# EAGLE design LPEM (EAGLE 9.4.1)

## Sheet 1 of 2
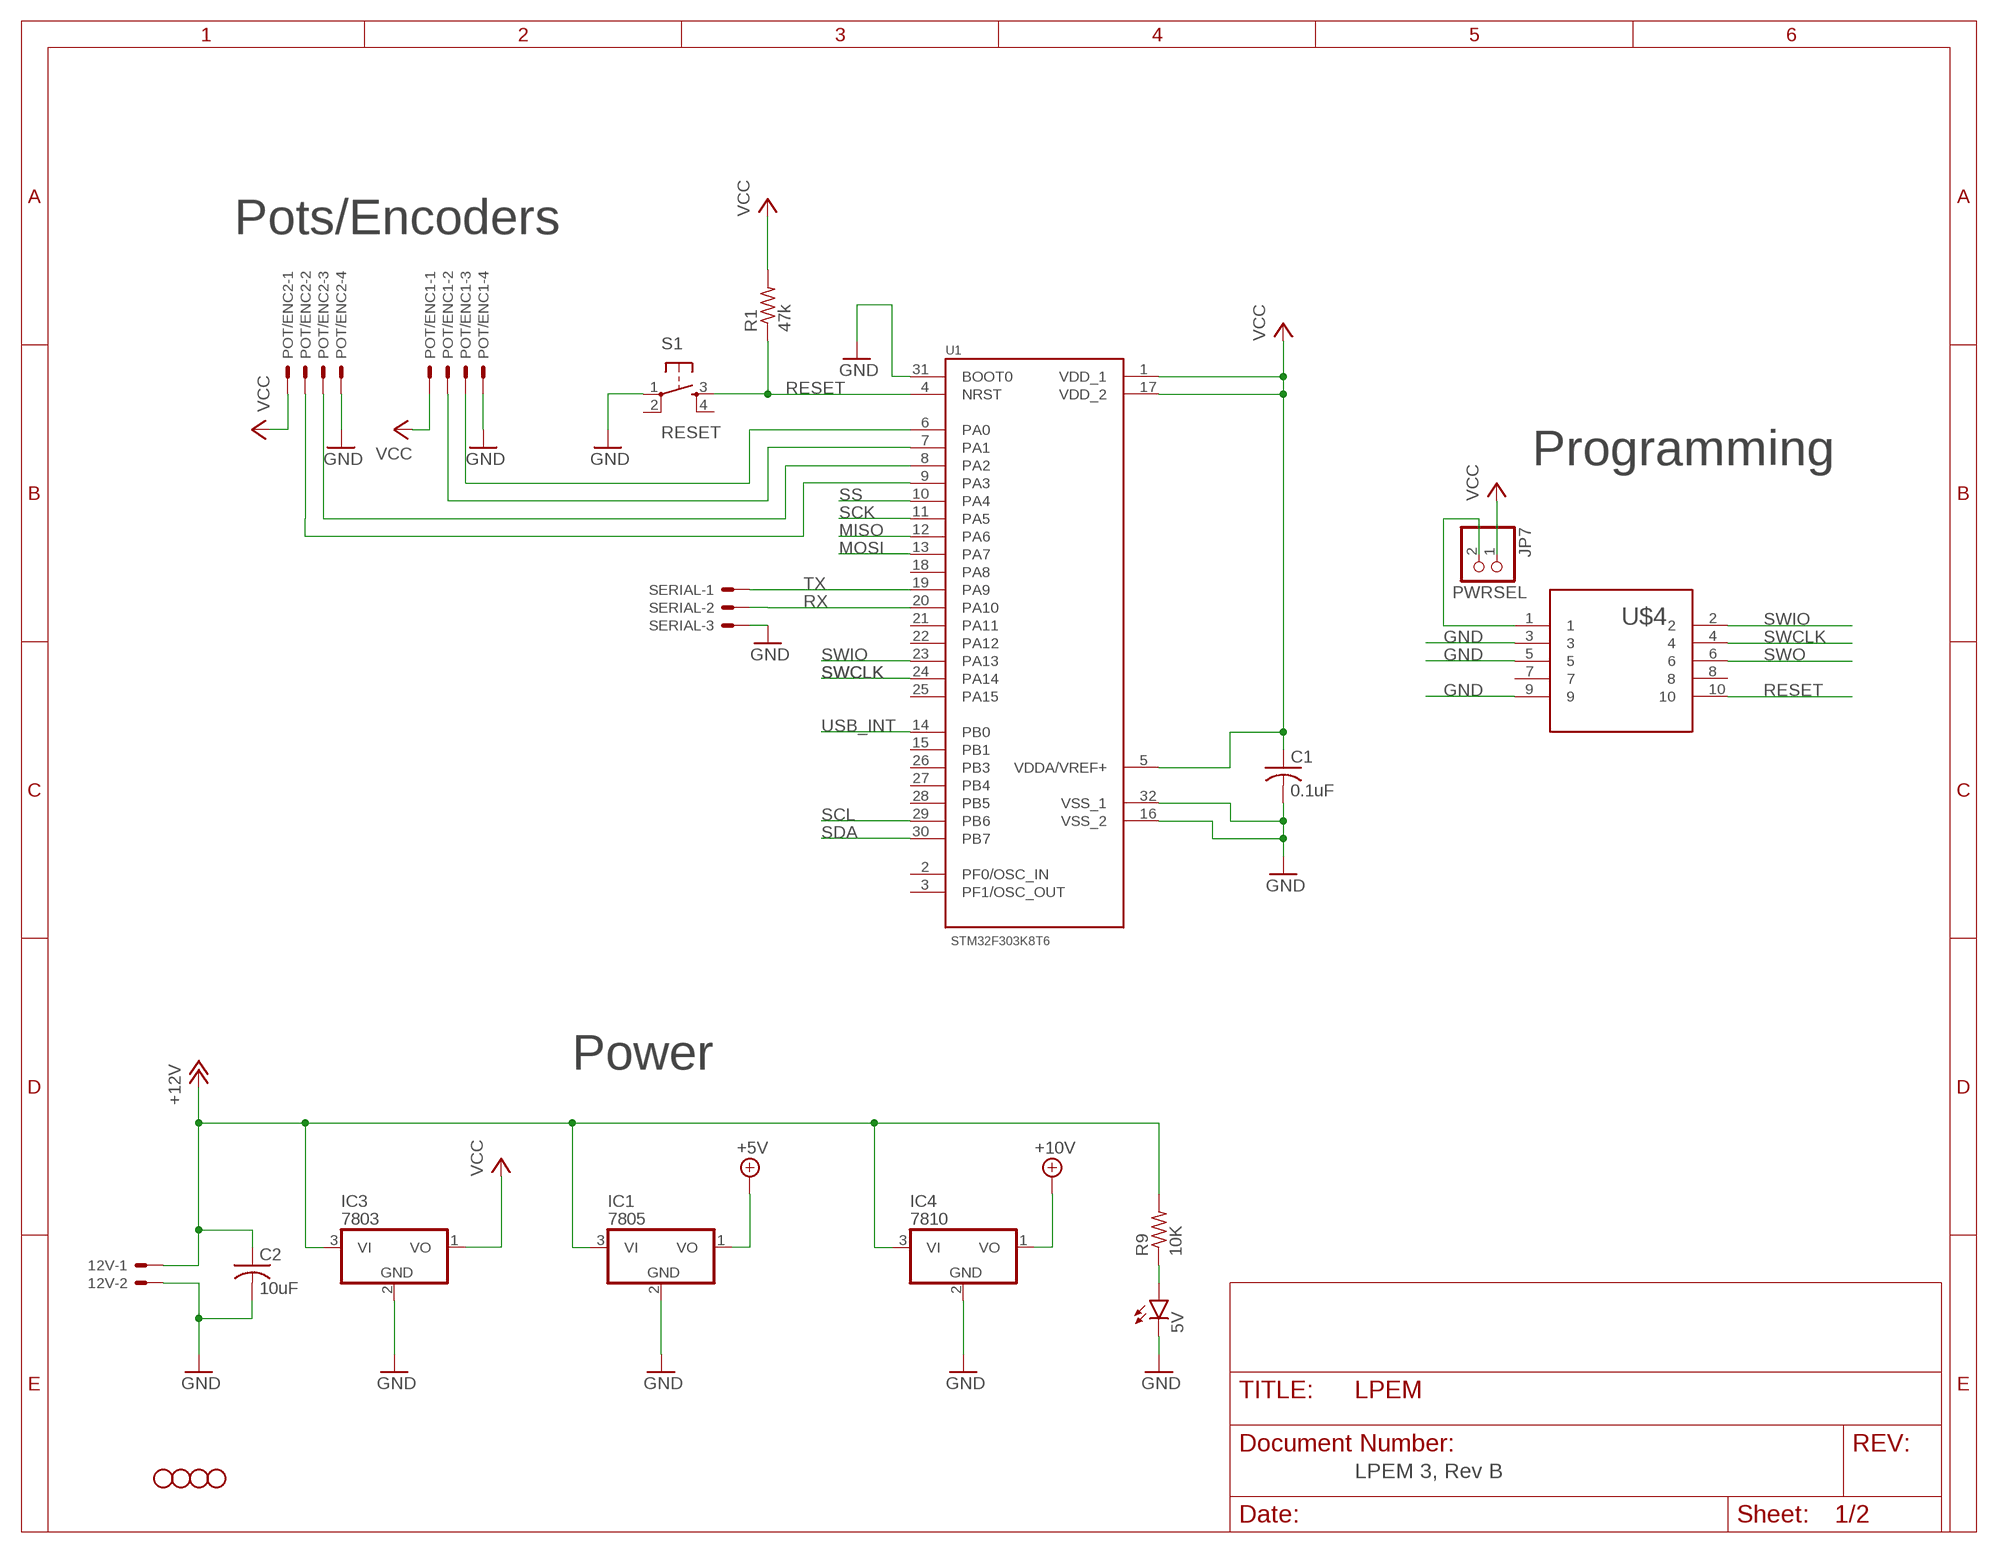
[diagram p0: schematic, sheet 1]

### Parts
5V  LED3MM  [LED3MM]
12V  22-23-2021  [22-23-2021]
C1  0.1uF  C-US025-025X050  [C025-025X050]
C2  10uF  C-US025-025X050  [C025-025X050]
IC1  7805  78L05Z  [TO92]
IC3  7803  78L05Z  [TO92]
IC4  7810  78L05Z  [TO92]
JP1  STAND-OFF  [STAND-OFF]
JP2  STAND-OFF  [STAND-OFF]
JP7  PWRSEL  PINHD-1X2  [1X02]
JP8  STAND-OFF  [STAND-OFF]
JP9  STAND-OFF  [STAND-OFF]
POT/ENC1  22-23-2041  [22-23-2041]
POT/ENC2  22-23-2041  [22-23-2041]
R1  47k  R-US_0204/5  [0204/5]
R9  10K  R-US_0204/5  [0204/5]
S1  RESET  TAC_SWITCHPTH  [TACTILE-PTH]
SERIAL  22-23-2031  [22-23-2031]
U1  STM32F303K8T6  [QFP80P900X900X160-32N]
U$4  CORTEX_HEADERJ  [CORTEX_HEADER]

### Nets
+5V [power]: IC1.1(VO) ; also sheet 2
+10V [power]: IC4.1(VO) ; also sheet 2
+12V [power]: 12V.1 C2.1 IC1.3(VI) IC3.3(VI) IC4.3(VI) R9.2 ; also sheet 2
GND [power]: 5V.K(C) 12V.2 C1.2 C2.2 IC1.2(GND) IC3.2(GND) IC4.2(GND) POT/ENC1.4 POT/ENC2.4 S1.1 SERIAL.3 U1.16(VSS_2) U1.31(BOOT0) U1.32(VSS_1) U$4.3 U$4.5 U$4.9 ; also sheet 2
MISO: U1.12(PA6) ; also sheet 2
MOSI: U1.13(PA7) ; also sheet 2
N$1: POT/ENC2.3 U1.8(PA2)
N$2: POT/ENC2.2 U1.9(PA3)
N$3: POT/ENC1.3 U1.6(PA0)
N$4: JP7.2 U$4.1
N$5: 5V.A R9.1
N$6: POT/ENC1.2 U1.7(PA1)
RESET: R1.1 S1.3 U1.4(NRST) U$4.10
RX: SERIAL.2 U1.20(PA10)
SCK: U1.11(PA5) ; also sheet 2
SCL: U1.29(PB6) ; also sheet 2
SDA: U1.30(PB7) ; also sheet 2
SS: U1.10(PA4) ; also sheet 2
SWCLK: U1.24(PA14) U$4.4
SWIO: U1.23(PA13) U$4.2
SWO: U$4.6
TX: SERIAL.1 U1.19(PA9)
USB_INT: U1.14(PB0) ; also sheet 2
VCC [power]: C1.1 IC3.1(VO) JP7.1 POT/ENC1.1 POT/ENC2.1 R1.2 U1.1(VDD_1) U1.5(VDDA/VREF+) U1.17(VDD_2) ; also sheet 2
Unconnected: S1.2 S1.4 U1.2(PF0/OSC_IN) U1.3(PF1/OSC_OUT) U1.15(PB1) U1.18(PA8) U1.21(PA11) U1.22(PA12) U1.25(PA15) U1.26(PB3) U1.27(PB4) U1.28(PB5) U$4.7 U$4.8

### Notes on the sheet
- Pots/Encoders
- Programming
- Power
- LPEM 3, Rev B

## Sheet 2 of 2
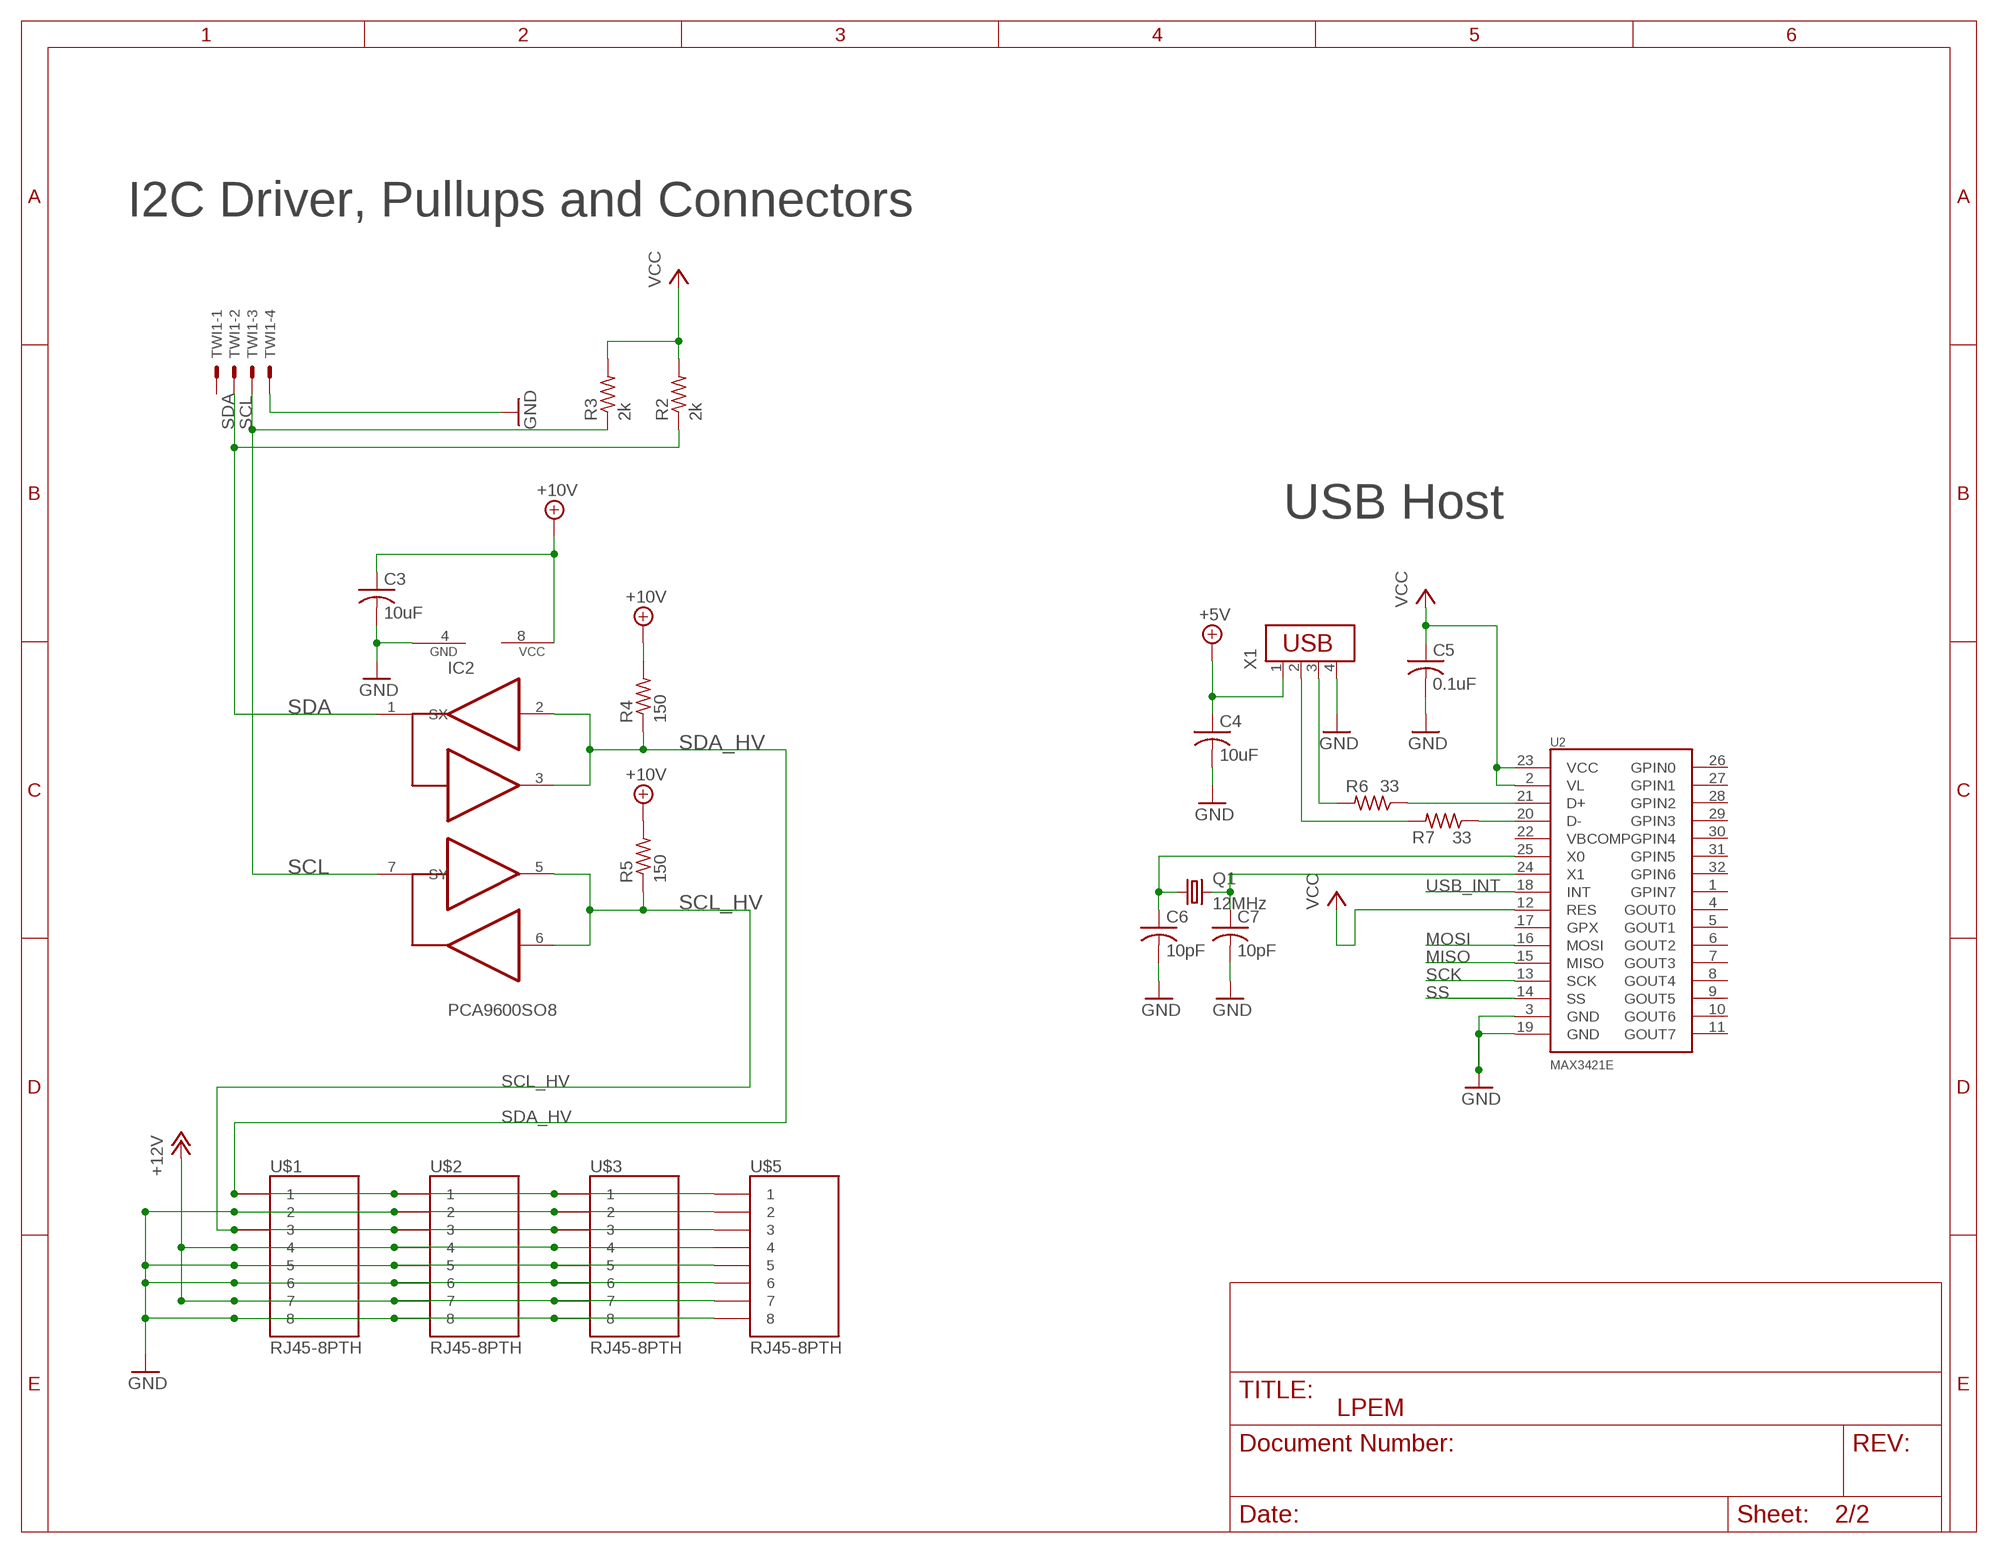
[diagram p1: schematic, sheet 2]

### Parts
C3  10uF  C-US025-025X050  [C025-025X050]
C4  10uF  C-US025-025X050  [C025-025X050]
C5  0.1uF  C-US025-025X050  [C025-025X050]
C6  10pF  C-US025-025X050  [C025-025X050]
C7  10pF  C-US025-025X050  [C025-025X050]
IC2  PCA9600SO8  [SO08]
Q1  12MHz  CRYSTALHC18U-V  [HC18U-V]
R2  2k  R-US_0204/5  [0204/5]
R3  2k  R-US_0204/5  [0204/5]
R4  150  R-US_0204/5  [0204/5]
R5  150  R-US_0204/5  [0204/5]
R6  33  R-US_0204/5  [0204/5]
R7  33  R-US_0204/5  [0204/5]
TWI1  22-23-2041  [22-23-2041]
U2  MAX3421E  [TQFP32-5MM]
U$1  RJ45-8PTH  [RJ45-8]
U$2  RJ45-8PTH  [RJ45-8]
U$3  RJ45-8PTH  [RJ45-8]
U$5  RJ45-8PTH  [RJ45-8]
X1  USB-787616  [USB]

### Nets
+5V [power]: C4.1 X1.1 ; also sheet 1
+10V [power]: C3.1 IC2.8(VCC) R4.2 R5.2 ; also sheet 1
+12V [power]: U$1.4 U$1.7 U$2.4 U$2.7 U$3.4 U$3.7 U$5.4 U$5.7 ; also sheet 1
GND [power]: C3.2 C4.2 C5.2 C6.2 C7.2 IC2.4(GND) TWI1.4 U2.3(GND) U2.19(GND) U$1.2 U$1.5 U$1.6 U$1.8 U$2.2 U$2.5 U$2.6 U$2.8 U$3.2 U$3.5 U$3.6 U$3.8 U$5.2 U$5.5 U$5.6 U$5.8 X1.4 ; also sheet 1
MISO: U2.15(MISO) ; also sheet 1
MOSI: U2.16(MOSI) ; also sheet 1
N$7: R6.2 X1.3
N$8: R7.2 X1.2
N$9: C6.1 Q1.1 U2.25(X0)
N$10: C7.1 Q1.2 U2.24(X1)
N$11: R6.1 U2.21(D+)
N$12: R7.1 U2.20(D-)
SCK: U2.13(SCK) ; also sheet 1
SCL: IC2.7(SY) R3.1 TWI1.3 ; also sheet 1
SCL_HV: IC2.5(TY) IC2.6(RY) R5.1 U$1.3 U$2.3 U$3.3 U$5.3
SDA: IC2.1(SX) R2.1 TWI1.2 ; also sheet 1
SDA_HV: IC2.2(RX) IC2.3(TX) R4.1 U$1.1 U$2.1 U$3.1 U$5.1
SS: U2.14(SS) ; also sheet 1
USB_INT: U2.18(INT) ; also sheet 1
VCC [power]: C5.1 R2.2 R3.2 U2.2(VL) U2.12(RES) U2.23(VCC) ; also sheet 1
Unconnected: TWI1.1 U2.1(GPIN7) U2.4(GOUT0) U2.5(GOUT1) U2.6(GOUT2) U2.7(GOUT3) U2.8(GOUT4) U2.9(GOUT5) U2.10(GOUT6) U2.11(GOUT7) U2.17(GPX) U2.22(VBCOMP) U2.26(GPIN0) U2.27(GPIN1) U2.28(GPIN2) U2.29(GPIN3) U2.30(GPIN4) U2.31(GPIN5) U2.32(GPIN6)

### Notes on the sheet
- I2C Driver, Pullups and Connectors
- USB Host

## Library data of the parts
5V = led:LED: LED OSRAM: - CHIPLED LG R971, LG N971, LY N971, LG Q971, LY Q971, LO R971, LY R971 LH N974, LH R974 LS Q976, LO Q976, LY Q976 LO Q996 - Hyper CHIPLED LW Q18S LB Q993, LB Q99A, LB R99A - SideLED LS A670, LO A670, LY A670, LG A670, LP A670 LB A673, LV A673, LT A673, LW A673 LH A674 LY A675 LS A676, LA A676, LO A676, LY A676, LW A676 LS A679, LY A679, LG A679 - Hyper Micro SIDELED® LS Y876, LA Y876, LO Y876, LY Y876 LT Y87S - SmartLED LW L88C, LW L88S LB L89C, LB L89S, LG L890 LS L89K, LO L89K, LY L89K LS L896, LA L896, LO L896, LY L896 - TOPLED LS T670, LO T670, LY T670, LG T670, LP T670 LSG T670, LSP T670, LSY T670, LOP T670, LYG T670 LG T671, LOG T671, LSG T671 LB T673, LV T673, LT T673, LW T673 LH T674 LS T676, LA T676, LO T676, LY T676, LB T676, LH T676, LSB T676, LW T676 LB T67C, LV T67C, LT T67C, LS T67K, LO T67K, LY T67K, LW E67C LS E67B, LA E67B, LO E67B, LY E67B, LB E67C, LV E67C, LT E67C LW T67C LS T679, LY T679, LG T679 LS T770, LO T770, LY T770, LG T770, LP T770 LB T773, LV T773, LT T773, LW T773 LH T774 LS E675, LA E675, LY E675, LS T675 LS T776, LA T776, LO T776, LY T776, LB T776 LHGB T686 LT T68C, LB T68C - Hyper Mini TOPLED® LB M676 - Mini TOPLED Santana® LG M470 LS M47K, LO M47K, LY M47K Source: http://www.osram.convergy.de LUXEON: - LUMILED® LXK2-PW12-R00, LXK2-PW12-S00, LXK2-PW14-U00, LXK2-PW14-V00 LXK2-PM12-R00, LXK2-PM12-S00, LXK2-PM14-U00 LXK2-PE12-Q00, LXK2-PE12-R00, LXK2-PE12-S00, LXK2-PE14-T00, LXK2-PE14-U00 LXK2-PB12-K00, LXK2-PB12-L00, LXK2-PB12-M00, LXK2-PB14-N00, LXK2-PB14-P00, LXK2-PB14-Q00 LXK2-PR12-L00, LXK2-PR12-M00, LXK2-PR14-Q00, LXK2-PR14-R00 LXK2-PD12-Q00, LXK2-PD12-R00, LXK2-PD12-S00 LXK2-PH12-R00, LXK2-PH12-S00 LXK2-PL12-P00, LXK2-PL12-Q00, LXK2-PL12-R00 Source: www.luxeon.com KINGBRIGHT: KA-3528ASYC Source: www.kingbright.com
12V = con-molex:22-23-2021: .100" (2.54mm) Center Header - 2 Pin; MF: MOLEX; MPN: 22-23-2021; OC_FARNELL: 1462926; OC_NEWARK: 25C3832
C1-C7 = rcl:C-US: CAPACITOR, American symbol; SPICEPREFIX: C
IC1 IC3 IC4 = linear:78*: Positive VOLTAGE REGULATOR Source: http://cache.national.com/ds/LM/LM78L05.pdf http://www.fairchildsemi.com/ds/LM/LM7805.pdf
IC2 = 4534_I2C2:PCA9600: I2C ACTIVE TERMINATOR SO-8
JP1 JP2 JP8 JP9 = SparkFun:STAND-OFF: Stand Off This is the mechanical footprint for a #4 phillips button head screw. Use the keepout ring to avoid running the screw head into surrounding components. SKU : PRT-00447
JP7 = pinhead:PINHD-1X2: PIN HEADER
POT/ENC1 POT/ENC2 TWI1 = con-molex:22-23-2041: .100" (2.54mm) Center Header - 4 Pin; MF: MOLEX; MPN: 22-23-2041; OC_FARNELL: 1462920; OC_NEWARK: 38C0355
Q1 = crystal:CRYSTAL: CRYSTAL; OC_FARNELL: unknown; OC_NEWARK: unknown
R1-R7 R9 = rcl:R-US_: RESISTOR, American symbol; SPICEPREFIX: R
S1 = SparkFun:TAC_SWITCH: Momentary Switch Button commonly used for reset or general input. Spark Fun Electronics SKU : COM-00097
SERIAL = con-molex:22-23-2031: .100" (2.54mm) Center Header - 3 Pin; MF: MOLEX; MPN: 22-23-2031; OC_FARNELL: 1462950; OC_NEWARK: 30C0862
U1 = STM32F303K8T6:STM32F303K8T6: Analog and DSP with FPU ARM Cortex-M4 MCU with 64 Kbytes Flash, 72 MHz CPU, CCM, 12-bit ADC 5 MSPS, comparators, op-amp; AVAILABILITY: Unavailable; DESCRIPTION: Analog and DSP with FPU ARM Cortex-M4 MCU with 64 Kbytes Flash, 72 MHz CPU, CCM, 12-bit ADC 5 MSPS, comparators, op-amp; MF: STMicroelectronics; MP: STM32F303K8T6; PACKAGE: LQFP-32 STMicroelectronics; PRICE: None
U2 = MAX3421E:MAX3421E: USB Peripheral/Host Controller with SPI Interface.; AVAILABILITY: Unavailable; DESCRIPTION: 1.2v To +5.5v, ±15kv Esd-Protected, 0.1µa, 35mbps, 8-Channel Level Translators; MF: Maxim Integrated; MP: MAX3421E; PACKAGE: None; PRICE: None
U$1-U$3 U$5 = SparkFun:RJ45-8: RJ45 Jack Simple RJ45, 8-pin connection - connector for common Cat5, Cat5e, and Cat6 Ethernet cables. Footprint not yet proven in production. Connector sku is PRT-00643; Breakout PCB sku is BOB-00716.
U$4 = Lectrobox:CORTEX_HEADER; AVAILABILITY: Unavailable; DESCRIPTION: Conn Shrouded Header HDR 10 POS 1.27mm Solder ST Thru-Hole Tube; MF: Samtec Inc.; MP: TFM-105-01-S-D-WT; PACKAGE: None; PRICE: None
X1 = con-amp:USB-787616: AMP connector

## Net classes
0 default: width 0.152 mm, drill 0.152 mm, clearance 0.152 mm
1 power: width 0.305 mm, drill 0.305 mm, clearance 0.152 mm to class 0, clearance 0.152 mm

## Board
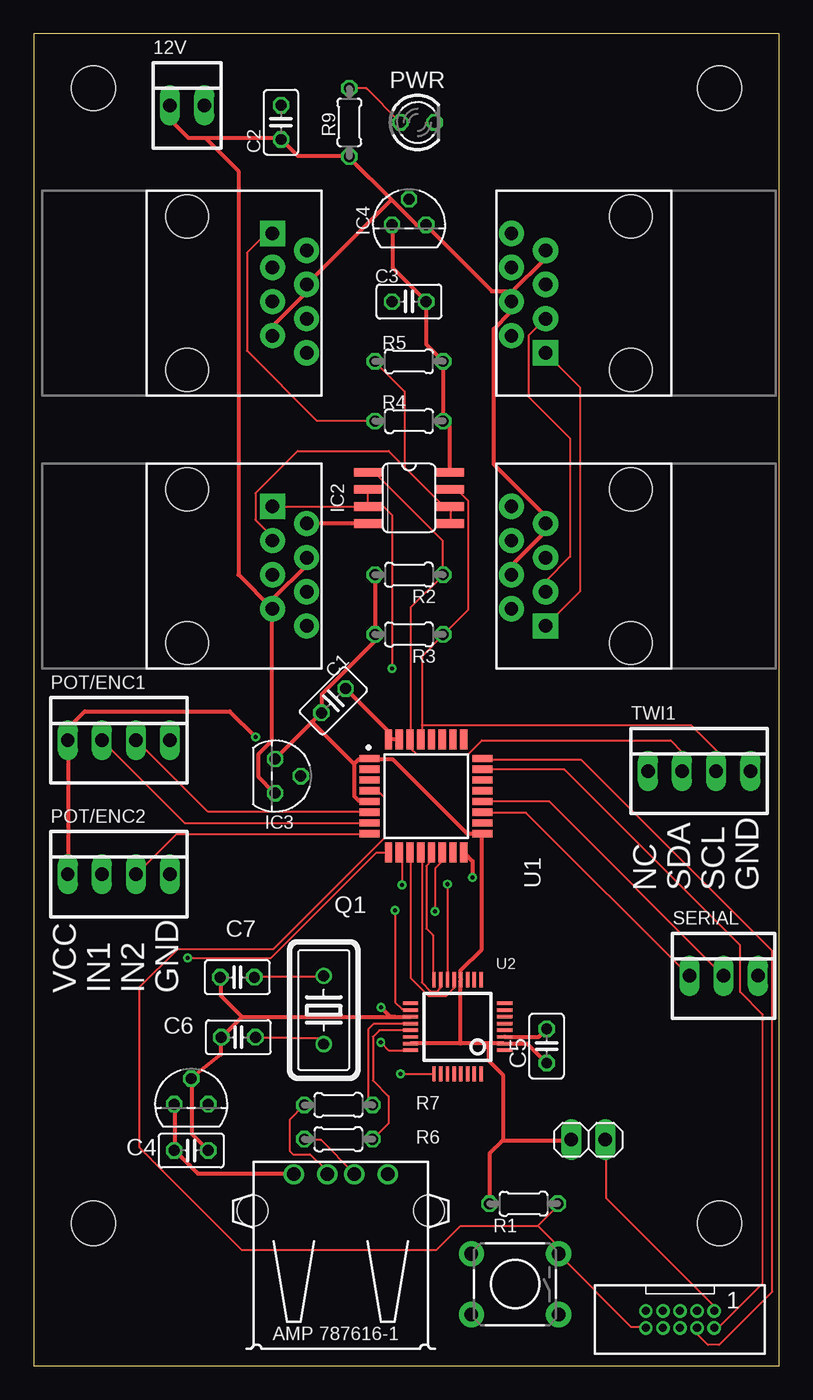
[diagram p2: board, top side]
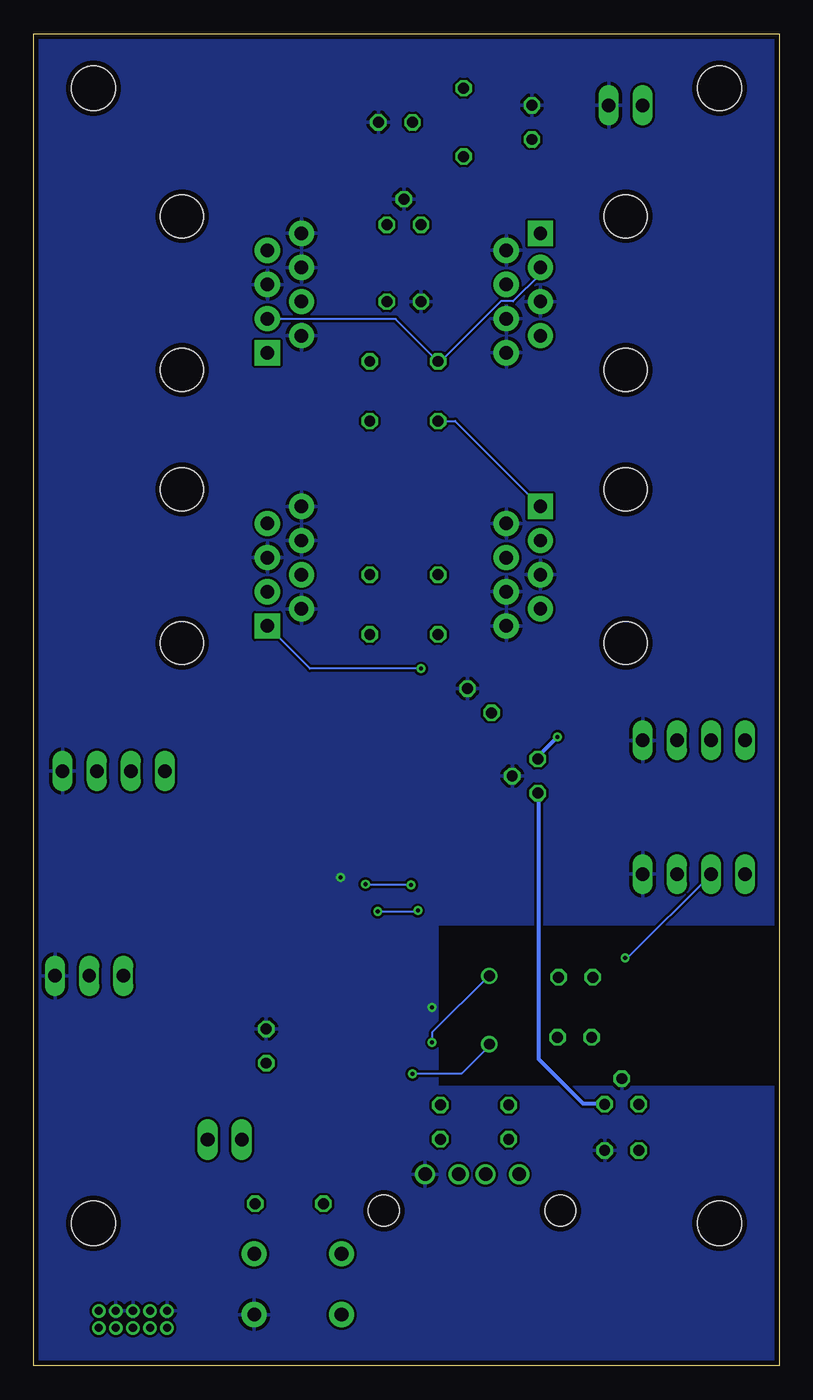
[diagram p3: board, bottom side, seen from below]

Size 55.5 x 99.12 mm. Coordinates in mm from the lower left corner, seen from the top.
Outline: 0,0 55.5,0 55.5,99.12 0,99.12 0,0
Copper layers (1*16): Top 0.0356mm / dielectric 1.5011mm / Bottom 0.0356mm
Design rules "DorkbotPDX *": minimum track width 6mil, minimum drill 12mil, track to track 7mil, track to pad 7mil, pad to pad 7mil, via to via 7mil, smd to smd 6mil, copper to edge 15mil, drill to drill 15mil, minimum pad ring 7mil, minimum via ring 7mil, stop-mask expansion 4mil, vias tented up to drill 13mil, thermal gap 10mil
tRestrict: area -1.3,96.6 to 6.3,100.4; area -1,92.8 to 2.3,96.6; area 1.5,7.3 to 7.5,13.6; area 48.1,7.4 to 54.1,13.7

### Footprints (pad centres in the part's own frame; a part is rotated, then mirrored left to right if it is on the bottom)
LED3MM = drill 0.813 octagon: A -1.27,0; K 1.27,0
22-23-2021 = drill 1 long: 1 -1.27,0; 2 1.27,0
C025-025X050 = drill 0.813 octagon: 1 -1.27,0; 2 1.27,0
TO92 = drill 0.813 octagon: 1 -1.27,0; 2 0,1.905; 3 1.27,0
SO08 = smd 0.66 x 2.032: 1 -1.905,-3.073; 2 -0.635,-3.073; 3 0.635,-3.073; 4 1.905,-3.073; 5 1.905,3.073; 6 0.635,3.073; 7 -0.635,3.073; 8 -1.905,3.073
STAND-OFF = hole 3.302: 0,0
1X02 = drill 1.016 long: 1 -1.27,0; 2 1.27,0
22-23-2041 = drill 1 long: 1 -3.81,0; 2 -1.27,0; 3 1.27,0; 4 3.81,0
HC18U-V = drill 0.813: 1 -2.54,0; 2 2.54,0
0204/5 = drill 0.813 octagon: 1 -2.54,0; 2 2.54,0
TACTILE-PTH = drill 1.016 pad 1.88: 1 -3.251,2.261; 2 3.251,2.261; 3 -3.251,-2.261; 4 3.251,-2.261
22-23-2031 = drill 1 long: 1 -2.54,0; 2 0,0; 3 2.54,0
QFP80P900X900X160-32N = smd 1.5 x 0.55: 1 -4.2,2.8; 2 -4.2,2; 3 -4.2,1.2; 4 -4.2,0.4; 5 -4.2,-0.4; 6 -4.2,-1.2; 7 -4.2,-2; 8 -4.2,-2.8; 17 4.2,-2.8; 18 4.2,-2; 19 4.2,-1.2; 20 4.2,-0.4; 21 4.2,0.4; 22 4.2,1.2; 23 4.2,2; 24 4.2,2.8 | smd 0.55 x 1.5: 9 -2.8,-4.2; 10 -2,-4.2; 11 -1.2,-4.2; 12 -0.4,-4.2; 13 0.4,-4.2; 14 1.2,-4.2; 15 2,-4.2; 16 2.8,-4.2; 25 2.8,4.2; 26 2,4.2; 27 1.2,4.2; 28 0.4,4.2; 29 -0.4,4.2; 30 -1.2,4.2; 31 -2,4.2; 32 -2.8,4.2
TQFP32-5MM = smd 1.143 x 0.254: 1 -3.5,1.75; 2 -3.5,1.25; 3 -3.5,0.75; 4 -3.5,0.25; 5 -3.5,-0.25; 6 -3.5,-0.75; 7 -3.5,-1.25; 8 -3.5,-1.75; 17 3.5,-1.75; 18 3.5,-1.25; 19 3.5,-0.75; 20 3.5,-0.25; 21 3.5,0.25; 22 3.5,0.75; 23 3.5,1.25; 24 3.5,1.75 | smd 0.254 x 1.143: 9 -1.75,-3.5; 10 -1.25,-3.5; 11 -0.75,-3.5; 12 -0.25,-3.5; 13 0.25,-3.5; 14 0.75,-3.5; 15 1.25,-3.5; 16 1.75,-3.5; 25 1.75,3.5; 26 1.25,3.5; 27 0.75,3.5; 28 0.25,3.5; 29 -0.25,3.5; 30 -0.75,3.5; 31 -1.25,3.5; 32 -1.75,3.5
RJ45-8 = drill 1 pad 1.88 square: 1 -4.445,6.35 | drill 1 pad 1.88: 2 -3.175,8.89; 3 -1.905,6.35; 4 -0.635,8.89; 5 0.635,6.35; 6 1.905,8.89; 7 3.175,6.35; 8 4.445,8.89 | hole 3.2: -5.715,0; 5.715,0
CORTEX_HEADER = drill 0.6 pad 1: 1 -2.54,-0.635; 2 -2.54,0.635; 3 -1.27,-0.635; 4 -1.27,0.635; 5 0,-0.635; 6 0,0.635; 7 1.27,-0.635; 8 1.27,0.635; 9 2.54,-0.635; 10 2.54,0.635
USB = drill 1: 1 -3.5,12.99; 2 -1,12.99; 3 1,12.99; 4 3.5,12.99 | hole 2.3: -6.57,10.28; 6.57,10.28

### Placement (x,y rotation side)
5V  28.57,92.52 0 top
12V  11.43,93.79 0 top
C1  22.32,49.49 45 top
C2  18.41,92.52 90 top
C3  27.94,79.19 180 top
C4  11.73,16.03 0 top
C5  38.18,23.8 90 top
C6  15.24,24.45 180 top
C7  15.16,28.92 180 top
IC1  11.73,19.47 0 top
IC2  27.94,64.58 270 top
IC3  17.98,43.88 270 top
IC4  27.94,84.9 0 top
JP1  4.45,95.06 0 top
JP2  51.05,95.06 0 top
JP7  41.27,16.83 0 top
JP8  4.45,10.61 0 top
JP9  51.05,10.61 0 top
POT/ENC1  6.35,46.54 0 top
POT/ENC2  6.35,36.59 0 top
Q1  21.59,26.48 90 top
R1  36.47,12.06 180 top
R2  27.94,58.87 180 top
R3  27.94,54.42 180 top
R4  27.94,70.3 0 top
R5  27.94,74.74 0 top
R6  22.68,16.87 180 top
R7  22.68,19.41 180 top
R9  23.5,92.52 270 top
S1  35.83,6.08 180 top
SERIAL  51.36,29.02 0 top
TWI1  49.53,44.26 0 top
U1  29.21,42.4 0 top
U2  31.55,25.23 180 top
U$1  44.45,59.5 90 top
U$2  44.45,79.82 90 top
U$3  11.43,79.82 270 top
U$4  48.1,3.46 180 top
U$5  11.43,59.5 270 top
X1  22.86,1.27 0 top

### Tracks (layer width: path | path; a pad name or v marks a point on that pad's centre or on a via)
+5V
  Top 0.305: IC1.1 10.48,19.44 10.48,16.06 C4.1 10.57,15.98 12.22,14.33 19.32,14.33 X1.1
+10V
  Top 0.305: IC2.8 30.96,66.5 30.96,69.88 30.54,70.3 R4.2 30.46,70.38 30.46,74.59 R5.2 30.46,74.75 29.22,75.99 29.22,79.13 C3.1 29.14,79.29 26.75,81.69 26.75,84.82 IC4.1
+12V
  Top 0.305: U$2.4 35.58,79.21 35.58,79.87 38.06,82.35 38.06,82.92 U$2.7 | U$3.7 17.83,76.65 17.83,77.39 20.31,79.87 20.31,80.45 U$3.4 20.39,80.53 26.58,86.72 26.62,86.76 | 26.62,86.76 23.44,89.94 R9.2 23.44,90.02 19.65,90.02 18.49,91.18 C2.1 18.33,91.34 12.79,91.34 | 26.62,86.76 28.48,84.91 29.14,84.91 IC4.3 29.22,84.82 34.09,79.95 35.5,79.95 U$2.4 | 12V.1 10.16,92.71 11.53,91.34 12.79,91.34 | U$1.4 35.58,58.9 35.58,59.56 38.06,62.04 38.06,62.62 U$1.7 38.06,62.78 38.06,63.28 34.26,67.08 34.26,77.15 35.5,78.39 35.5,79.05 U$2.4 | 17.83,56.34 17.83,57.09 20.31,59.56 20.31,60.06 U$5.4 | 17.83,56.34 U$5.7 17.75,56.26 17.75,46.53 16.75,45.53 16.75,43.8 17.91,42.64 IC3.3 | 12.79,91.34 15.24,88.9 15.24,58.87 17.76,56.34 17.83,56.34
  Bottom 0.305: IC3.3 17.91,42.56 17.91,22.82 17.83,22.75 14.61,19.53 13.04,19.53 IC1.3
GND  (via drill 0.3)
  Top 0.305: 15.52,25.97 26.92,25.97 | 26.92,25.97 27.98,25.97 U2.19 | 15.52,25.97 14.03,24.48 C6.2 13.95,24.32 13.95,23.17 IC1.2 11.8,21.26 11.8,17.21 12.96,16.06 C4.2 | C7.2 13.95,28.86 13.95,27.53 15.44,26.05 15.52,25.97 | 31.95,38.27 U1.16 32.67,37.54 v32.67,36.33 | 27.24,46.44 U1.31 27.16,46.6 U1.32 26.33,46.69 26.33,47.26 23.28,50.32 C1.2 | IC2.4 24.85,62.7 20.39,62.7 U$5.2 | 26.92,25.97 26.56,25.97 v25.86,26.67 | U2.3 37.59,24.48 C5.2
  Bottom 0.305: v32.67,36.33 32.76,36.33 32.77,36.32
  pour Bottom: 0,99.5 55.24,99.5 55.88,98.87 55.88,-0.36 0,-0.36 0,20.77 25.4,20.77 25.4,32.83 0,32.83
MISO
  Top 0.152: U2.15 30.3,28.69 30.3,28.11 30.05,27.86 29.55,27.86 28.89,28.52 28.89,38.18 U1.12
MOSI
  Top 0.152: U2.16 29.72,28.77 29.72,32.05 29.22,32.54 29.22,37.19 29.55,37.52 29.55,38.18 U1.13
N$1
  Top 0.152: U1.8 24.93,39.59 10.65,39.59 7.68,36.62 POT/ENC2.3
N$2  (via drill 0.3)
  Top 0.152: v11.47,30.34 17.67,30.34 25.51,38.18 26.33,38.18 U1.9
  Bottom 0.152: v11.47,30.34 11.31,30.34 5.12,36.53 POT/ENC2.2
N$3
  Top 0.152: U1.6 24.93,41.24 12.96,41.24 7.68,46.52 POT/ENC1.3
N$4
  Top 0.152: U$4.1 50.6,4.13 50.6,4.51 42.6,12.52 42.6,16.02 42.6,16.76 JP7.2
N$5
  Top 0.152: R9.1 23.53,95.06 24.77,95.06 27.24,92.58 5V.A
N$6
  Top 0.152: U1.7 24.93,40.41 11.23,40.41 5.12,46.52 POT/ENC1.2
N$7
  Top 0.152: R6.2 20.23,16.8 21.38,16.8 23.86,14.33 X1.3
N$8
  Top 0.152: R7.2 19.05,18.32 19.05,16 19.3,15.75 20.57,15.75 21.86,14.46 X1.2
N$9  (via drill 0.3)
  Top 0.152: C6.1 16.51,24.4 19.05,24.4 21.13,24.4 Q1.1 | v27.3,21.73 U2.25 | U2.25
  Bottom 0.152: v27.3,21.73 23.67,21.73 21.59,23.81 Q1.1
N$10  (via drill 0.3)
  Top 0.152: v25.84,24.06 26.41,23.49 27.98,23.49 U2.24 | C7.1 16.51,28.94 21.46,28.94 21.55,29.02 Q1.2
  Bottom 0.152: v25.84,24.06 25.84,24.81 21.63,29.02 Q1.2
N$11
  Top 0.152: U2.21 25.74,24.98 25.25,24.49 25.25,21.23 26.42,20.07 26.42,18.06 R6.1
N$12
  Top 0.152: 27.98,25.47 U2.20 27.98,25.47 | 27.98,25.47 25.32,25.47 24.92,25.07 24.92,19.63 R7.1
RESET
  Top 0.152: U$4.10 45.48,2.89 44.49,2.89 39.08,8.3 | 39.08,8.3 S1.3 | 37.52,10.41 31.75,10.41 29.97,8.64 15.49,8.64 7.87,16.26 7.87,28.16 10.72,31 17.83,31 26.09,39.26 26.09,42.31 25.67,42.72 25.08,42.72 U1.4 | 37.52,10.41 39.08,8.86 39.08,8.3 | 37.52,10.41 39.01,11.9 R1.1
RX
  Top 0.152: U1.20 33.43,41.98 38.39,41.98 51.35,29.02 SERIAL.2
SCK
  Top 0.152: U2.13 31.29,28.69 31.29,28.11 30.71,27.53 29.39,27.53 28.07,28.86 28.07,38.18 U1.11
SCL
  Top 0.152: 28.89,47.68 28.89,52.79 30.46,54.36 R3.1 30.54,54.45 32.36,56.26 32.36,64.35 31.53,65.18 31.04,65.18 IC2.7 | 28.89,47.68 28.89,46.6 U1.29 | TWI1.3 50.8,45.78 48.91,47.68 28.89,47.68
SCL_HV
  Top 0.152: U$1.3 38.14,57.66 38.14,58.41 39.93,60.2 39.93,69.03 36.83,72.12 36.83,76.64 U$2.3 | IC2.5 31.04,62.7 31.04,63.94 IC2.6 30.96,64.02 30.46,64.02 27.97,66.51 | 27.97,66.51 27.6,66.88 27.6,72.49 25.43,74.67 R5.1 | U$5.3 17.75,61.46 17.75,61.71 16.51,62.95 16.51,64.93 19.65,68.07 26.42,68.07 27.97,66.51
  Bottom 0.152: U$3.3 17.83,81.69 17.83,81.19 19.81,79.21 20.72,79.21 25.18,74.75 25.34,74.75 R5.1 25.43,74.75 28.56,77.89 38.06,77.89 U$2.3
SDA
  Top 0.152: IC2.1 24.93,66.42 25.43,66.42 30.46,61.38 30.46,58.9 R2.1 30.46,58.82 28.07,56.43 28.07,46.6 U1.30 28.07,46.52 28.07,45.94 28.48,45.53 32.36,45.53 33.36,46.53 47.41,46.53 48.26,45.69 TWI1.2
SDA_HV  (via drill 0.3)
  Top 0.152: IC2.3 24.85,64.02 24.85,65.18 IC2.2 | IC2.3 24.85,63.94 17.83,63.94 U$5.1 | U$3.1 17.32,84.27 15.88,82.82 15.88,75.52 21.1,70.3 25.34,70.3 R4.1 | U$2.1 40.64,72.83 40.64,57.59 U$1.1 | IC2.3 26.04,63.95 26.67,63.31 v26.67,51.88
  Bottom 0.152: U$5.1 24.13,70.3 R4.1 | v26.67,51.88 34.92,51.88 U$1.1
SS  (via drill 0.3)
  Top 0.152: v30.79,35.84 30.79,28.77 U2.14 | v27.41,35.79 27.41,38.02 27.24,38.18 U1.10
  Bottom 0.152: v30.79,35.84 30.74,35.79 v27.41,35.79
SWCLK
  Top 0.152: 34.09,45.12 33.43,45.12 U1.24 34.09,45.12 | U$4.4 49.38,2.38 50.19,1.56 51.02,1.56 54.98,5.53 54.98,30.87 40.73,45.12 34.09,45.12
SWIO
  Top 0.152: 34.09,44.37 33.43,44.37 U1.23 34.09,44.37 | 34.09,44.37 39.49,44.37 52.58,31.29 52.58,27.82 54.23,26.16 54.23,6.1 50.96,2.83 U$4.2
TX
  Top 0.152: U1.19 33.43,41.16 36.65,41.16 48.79,29.02 SERIAL.1
USB_INT  (via drill 0.3)
  Top 0.152: v26.91,33.88 26.91,27.05 27.41,26.54 27.98,26.54 U2.18 | v29.88,33.81 29.88,37.03 30.38,37.52 30.38,38.18 U1.14
  Bottom 0.152: v29.88,33.81 26.98,33.81 v26.91,33.88
VCC  (via drill 0.3)
  Top 0.305: POT/ENC2.1 2.56,36.62 2.56,46.52 POT/ENC1.1 2.54,47.44 3.81,48.7 14.61,48.7 v16.51,46.8 | R2.2 25.43,58.82 25.43,54.45 R3.2 25.34,54.36 25.34,53.87 23.28,51.8 21.46,49.99 21.46,48.67 C1.1 21.38,48.58 20.72,47.92 | 23.86,44.79 23.86,42.39 24.19,42.06 24.93,42.06 U1.5 | 23.86,44.79 24.19,45.12 24.93,45.12 | 24.93,45.12 U1.1 | 20.72,47.92 18,45.2 IC3.1 | 23.86,44.79 23.77,44.87 20.8,47.84 20.72,47.92 | 33.84,23.98 35,23.98 U2.2 36.73,23.98 C5.1 | 33.84,23.98 31.78,23.98 | 31.78,23.98 28.07,23.98 U2.23 | 31.78,23.98 31.78,24.07 31.78,28.69 U2.12 31.78,28.86 31.78,29.43 33.35,31 33.35,39.59 U1.17 32.29,39.59 26.77,45.12 24.93,45.12 | 34.92,16.8 34.92,21.65 33.84,22.73 33.84,23.65 33.84,23.98 | JP7.1 40.01,16.8 34.92,16.8 | R1.2 33.93,12.1 33.93,15.81 34.84,16.72 34.92,16.8
  Bottom 0.305: v16.51,46.8 17.91,45.4 17.91,45.22 IC3.1

### Text on the board
tNames: PWR | NC | SDA | SCL | GND | VCC | IN1 | IN2 | GND
tDocu: 12V | GND | TX | RX | GND | LPEM v3.2 / June 2019 | RESET